# Altium schematic sheet 09A_USB_HUB.SchDoc
size 420 x 297 mm
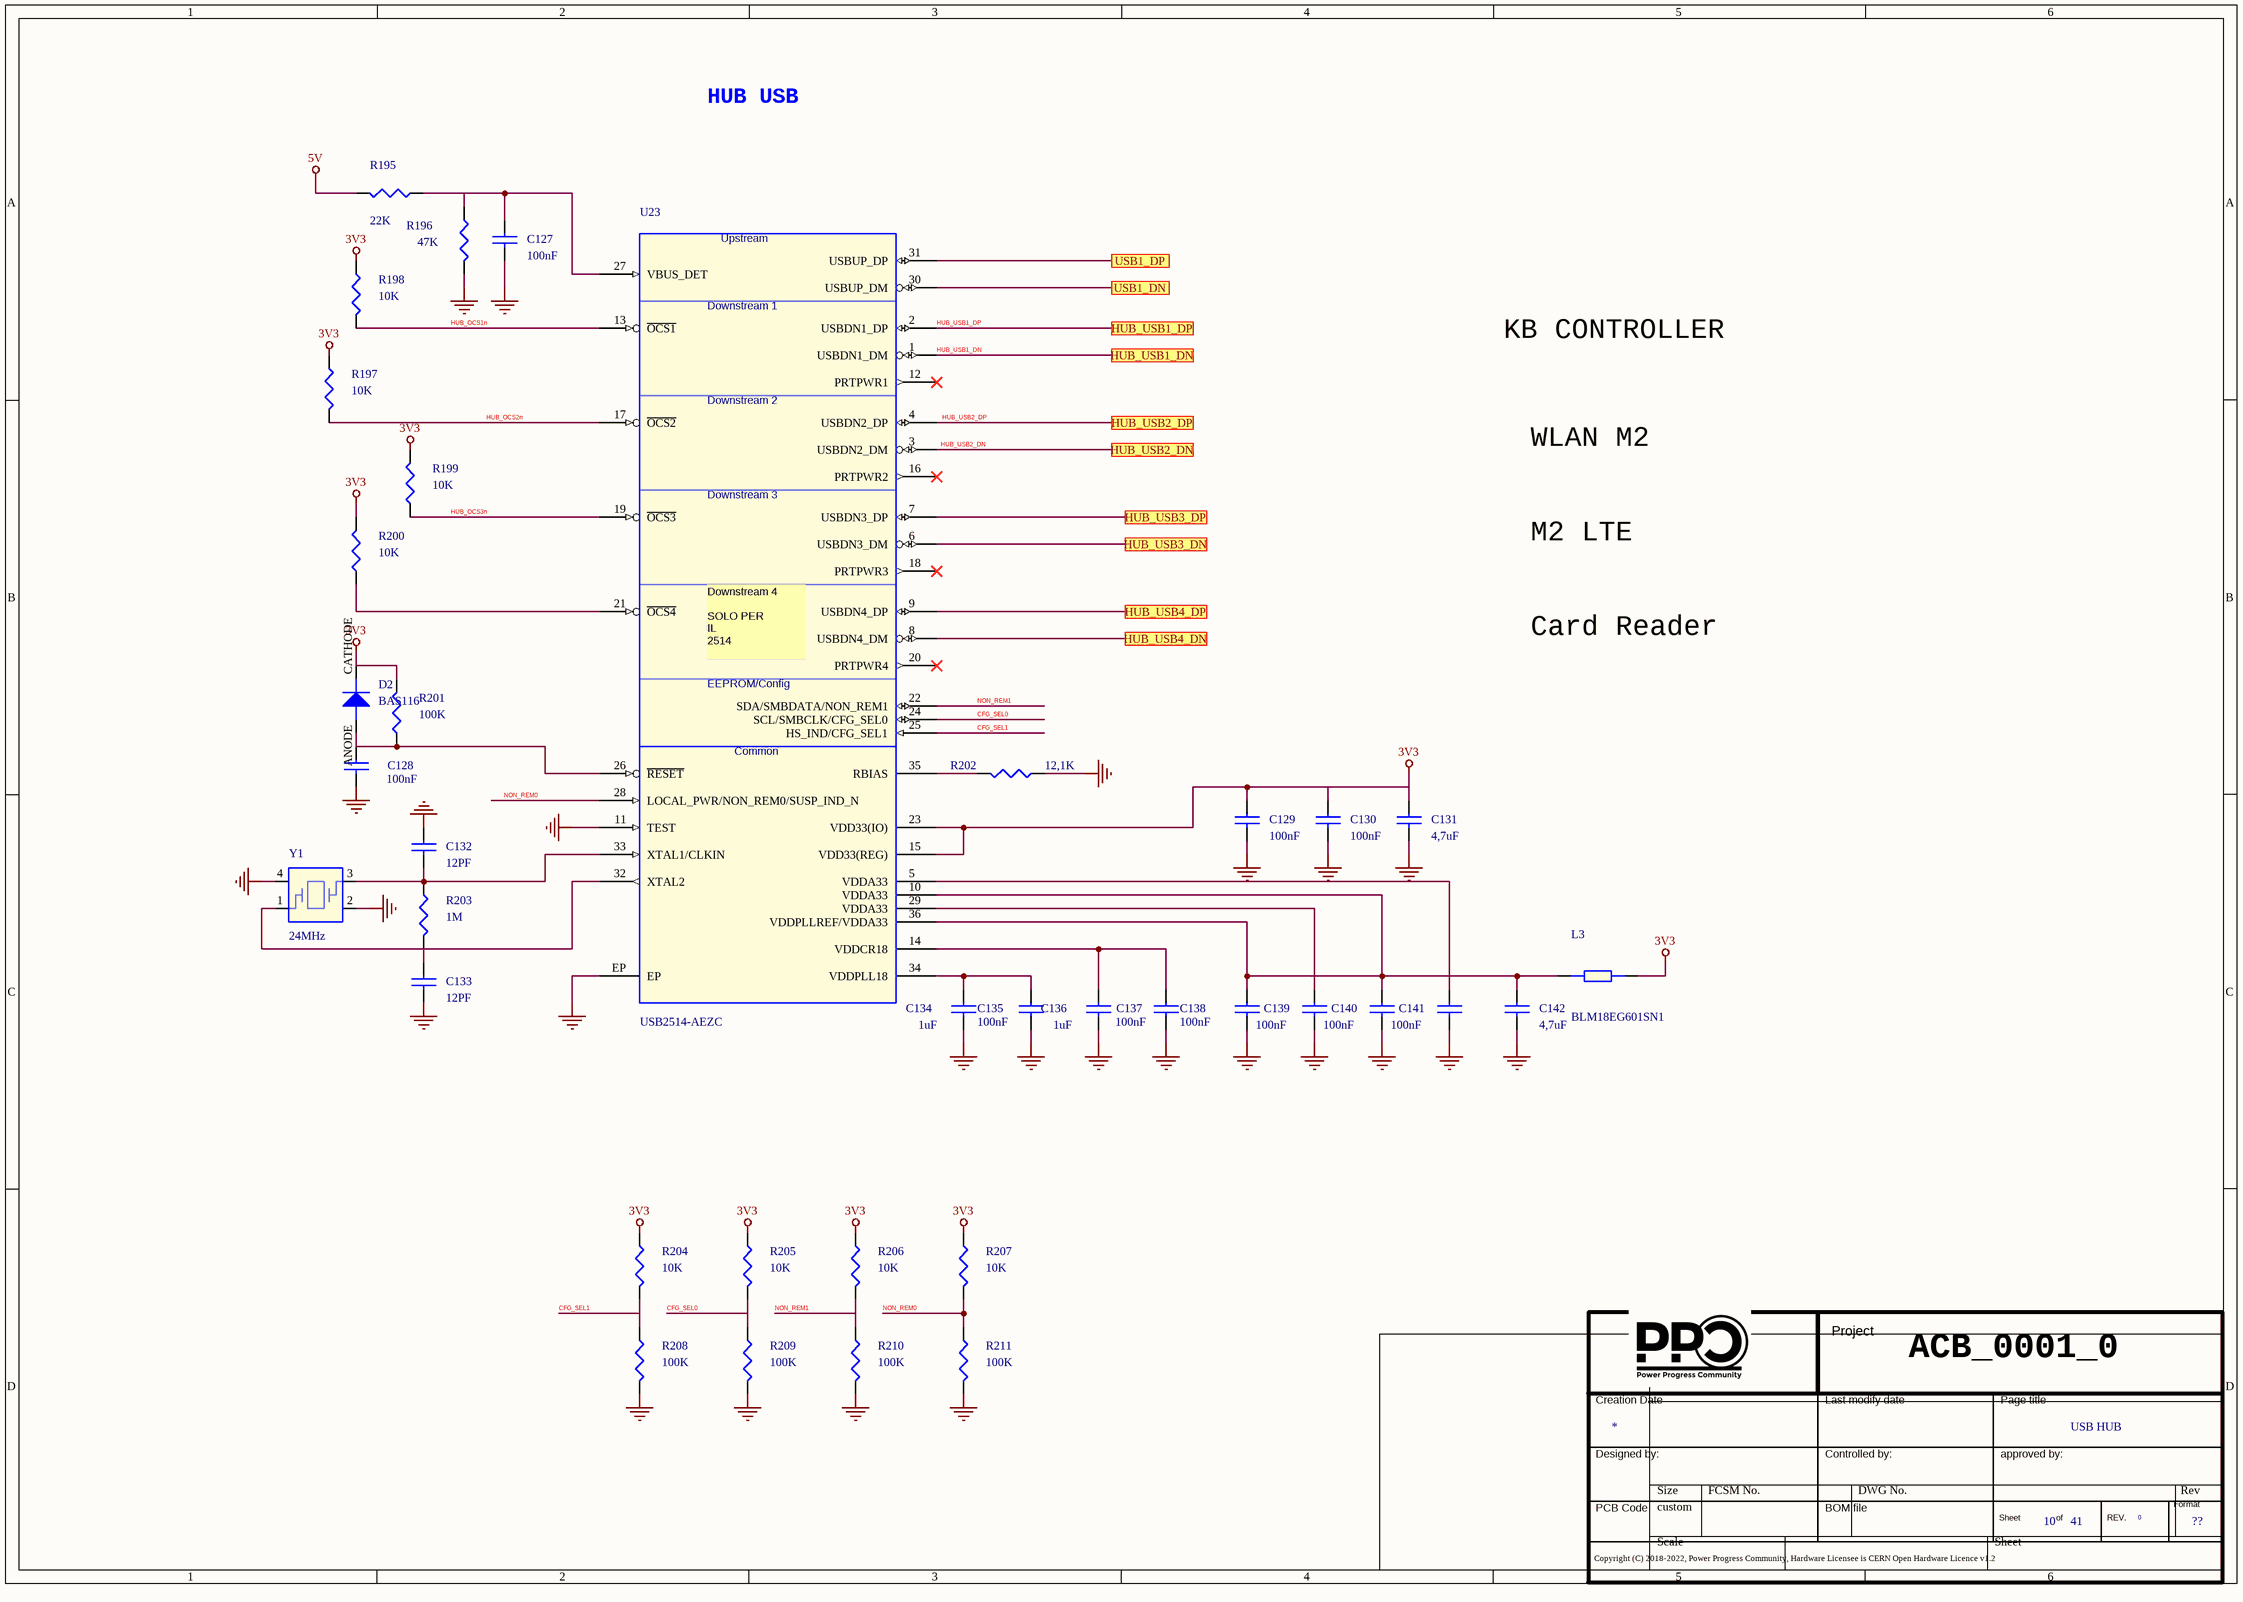
[diagram p0: 09A_USB_HUB.SchDoc]

## Parts
*  Doc: USB HUB  Page Count: 41  Page Number: 10  Page Size: ??  RevCode: 0  (hidden comment: Title_block_PPC)  (graphical)
C127  100nF  [SMD_0402]
C128  100nF  [SMD_0402]
C129  100nF  [SMD_0402]
C130  100nF  [SMD_0402]
C131  4,7uF  [SMD_0603]
C132  12PF  [SMD_0402]
C133  12PF  [SMD_0402]
C134  1uF  [SMD_0402]
C135  100nF  [SMD_0402]
C136  1uF  [SMD_0402]
C137  100nF  [SMD_0402]
C138  100nF  [SMD_0402]
C139  100nF  [SMD_0402]
C140  100nF  [SMD_0402]
C141  100nF  [SMD_0402]
C142  4,7uF  [SMD_0603]
D2  BAS116  [sod123]
L3  BLM18EG601SN1  [SMD_0603]
R195  22K  [SMD_0402]
R196  47K  [SMD_0402]
R197  10K  [SMD_0402]
R198  10K  [SMD_0402]
R199  10K  [SMD_0402]
R200  10K  [SMD_0402]
R201  100K  [SMD_0402]
R202  12,1K  [SMD_0402]
R203  1M  [SMD_0402]
R204  10K  [SMD_0402]
R205  10K  [SMD_0402]
R206  10K  [SMD_0402]
R207  10K  [SMD_0402]
R208  100K  [SMD_0402]
R209  100K  [SMD_0402]
R210  100K  [SMD_0402]
R211  100K  [SMD_0402]
U23  USB2514-AEZC  [QFN36]
Y1  24MHz  [SMD_2.5x3.2]

## Ports
HUB_USB1_DN, HUB_USB1_DP, HUB_USB2_DN, HUB_USB2_DP, HUB_USB3_DN, HUB_USB3_DP, HUB_USB4_DN, HUB_USB4_DP, USB1_DN, USB1_DP

## Nets
3V3: C129.1 C130.1 C131.1 D2.CATHODE L3.2 R197.1 R198.1 R199.1 R200.1 R201.1 R204.1 R205.1 R206.1 R207.1 U23.15(VDD33(REG)) U23.23(VDD33(IO))
5V: R195.1
GND: C127.2 C128.2 C129.2 C130.2 C131.2 C132.1 C133.2 C134.2 C135.2 C136.2 C137.2 C138.2 C139.2 C140.2 C141.2 C142.2 R196.1 R202.2 R208.2 R209.2 R210.2 R211.2 U23.11(TEST) U23.EP Y1.2 Y1.4
CFG_SEL0: R205.2 R209.1 U23.24(SCL/SMBCLK/CFG_SEL0)
CFG_SEL1: R204.2 R208.1 U23.25(HS_IND/CFG_SEL1)
HUB_OCS1n: R198.2 U23.13(~{OCS1})
HUB_OCS2n: R197.2 U23.17(~{OCS2})
HUB_OCS3n: R199.2 U23.19(~{OCS3})
HUB_USB1_DN: U23.1(USBDN1_DM) ; port HUB_USB1_DN
HUB_USB1_DP: U23.2(USBDN1_DP) ; port HUB_USB1_DP
HUB_USB2_DN: U23.3(USBDN2_DM) ; port HUB_USB2_DN
HUB_USB2_DP: U23.4(USBDN2_DP) ; port HUB_USB2_DP
HUB_USB3_DN: U23.6(USBDN3_DM) ; port HUB_USB3_DN
HUB_USB3_DP: U23.7(USBDN3_DP) ; port HUB_USB3_DP
HUB_USB4_DN: U23.8(USBDN4_DM) ; port HUB_USB4_DN
HUB_USB4_DP: U23.9(USBDN4_DP) ; port HUB_USB4_DP
NON_REM0: R207.2 R211.1 U23.28(LOCAL_PWR/NON_REM0/SUSP_IND_N)
NON_REM1: R206.2 R210.1 U23.22(SDA/SMBDATA/NON_REM1)
USB1_DN: U23.30(USBUP_DM) ; port USB1_DN
USB1_DP: U23.31(USBUP_DP) ; port USB1_DP
NetC127_1: C127.1 R195.2 R196.2 U23.27(VBUS_DET)
NetC128_1: C128.1 D2.ANODE R201.2 U23.26(~{RESET})
NetC132_2: C132.2 R203.1 U23.33(XTAL1/CLKIN) Y1.3
NetC133_1: C133.1 R203.2 U23.32(XTAL2) Y1.1
NetC134_1: C134.1 C135.1 U23.34(VDDPLL18)
NetC136_1: C136.1 C137.1 U23.14(VDDCR18)
NetC138_1: C138.1 C139.1 C140.1 C141.1 C142.1 L3.1 U23.5(VDDA33) U23.10(VDDA33) U23.29(VDDA33) U23.36(VDDPLLREF/VDDA33)
NetR200_2: R200.2 U23.21(~{OCS4})
NetR202_1: R202.1 U23.35(RBIAS)

Not connected (* = marked no-connect by the designer): U23 12(PRTPWR1)* 16(PRTPWR2)* 18(PRTPWR3)* 20(PRTPWR4)*

## Notes on the sheet
- HUB USB
- KB CONTROLLER
- WLAN M2
- M2 LTE
- Card Reader
- ACB_0001_0
- (in symbol Title_block_PPC) Project; Creation Date; Last modify date; Page title; Designed by:; Controlled by:; approved by:; Format; PCB Code; BOM file; Sheet; of; REV.; Copyright (C) 2018-2022, Power Progress Community, Hardware Licensee is CERN Open Hardware Licence v1.2
- (in symbol USB2513_QFN36_0) Upstream; Downstream 1; Downstream 2; Downstream 3; Downstream 4 / SOLO PER / IL / 2514; EEPROM/Config; Common

## Library data of the parts
* = Title_block_PPC: Title: T2080PCIe; Author: MICETEK; Page Create Date: March  8, 1995; Page Title: ?; Page Modify Date: *
C127 C129 C130 C135 C139-C141 = CAP NP_Dup5: COND.CER. 100NF 50V 0402 X7R SMD; Manufacturer Part Number 1: CGA2B3X7R1H104M050BD; Manufacturer 1: TDK; Part Number: PASSIVE_24; TECNO77: C0402; RSM: RC0402; Distributor 1: MURATA ELETTRONICA SPA; Part Type: Capacitors\Ceramic\SMD\0402; PCB Footprint: SMD_0402
C128 C137 C138 = CAP NP_Dup5: COND.CER. 100NF 50V 0402 X7R SMD; Part Number: PASSIVE_24; Manufacturer 1: TDK; Manufacturer Part Number 1: CGA2B3X7R1H104M050BD; TECNO77: C0402; RSM: RC0402; Part Type: Capacitors\Ceramic\SMD\0402; Distributor 1: MURATA ELETTRONICA SPA; PCB Footprint: SMD_0402
C131 = CAP NP_Dup5: COND.CER.4,7uF 16V X5R 0603 SMD; Part Number: PASSIVE_1405; Manufacturer 1: SAMSUNG; Manufacturer Part Number 1: CL10A475KO8NNNC; TECNO77: C0603; RSM: RC0603; Part Type: Capacitors\Ceramic\SMD\0603; Distributor 1: DIGIKEY (490-3302-1-ND); PCB Footprint: SMD_0603
C132 = CAP NP_Dup5: COND.CER.12PF 50V 0402 NPO/COG SMD; Part Number: PASSIVE_36; Manufacturer 1: Murata; Manufacturer Part Number 1: GRM1555C1H120JZ01D; TECNO77: C0402; RSM: RC0402; Part Type: Capacitors\Ceramic\SMD\0402; Distributor 1: MURATA ELETTRONICA SPA; PCB Footprint: SMD_0402
C133 = CAP NP_Dup5: COND.CER.12PF 50V 0402 NPO/COG SMD; Manufacturer Part Number 1: GRM1555C1H120JZ01D; Manufacturer 1: Murata; Part Number: PASSIVE_36; TECNO77: C0402; RSM: RC0402; Distributor 1: MURATA ELETTRONICA SPA; Part Type: Capacitors\Ceramic\SMD\0402; PCB Footprint: SMD_0402
C134 C136 = CAP NP_Dup3: CAP CER 1UF 25V X6S 0402; Manufacturer Part Number 1: GRM155C81E105KE11D; Manufacturer 1: Murata; Part Number: PASSIVE_1446; RSM: RC0402; Part Type: Capacitors\Ceramic\SMD\0402; PCB Footprint: SMD_0402
C142 = CAP NP_Dup5: COND.CER.4,7uF 16V X5R 0603 SMD; Manufacturer Part Number 1: CL10A475KO8NNNC; Manufacturer 1: SAMSUNG; Part Number: PASSIVE_1405; TECNO77: C0603; RSM: RC0603; Distributor 1: DIGIKEY (490-3302-1-ND); Part Type: Capacitors\Ceramic\SMD\0603; PCB Footprint: SMD_0603
D2 = DIODE: DIODO, ALTA VELOCITÀ, SOD123; Part Number: DISCRETE_54; Manufacturer 1: NXP; Manufacturer Part Number 1: BAS116H,115; RSM: SOD123-AK; Part Type: Diodes\Rectifiers; PCB Footprint: sod123; Distributor 1: FARNELL(2319131)
L3 = FERRITE_BEAD: FERRITE BEAD 600ohm 500mA 0603 SMD; Part Number: PASSIVE_377; Manufacturer 1: Murata; Manufacturer Part Number 1: BLM18EG601SN1 SMD; RSM: RC0603; Part Type: Ferrite Beads\SMD\0603; PCB Footprint: SMD_0603
R195 = R_Dup5: RESIS.CHIP 22K 5% 0402 SMD; Part Number: PASSIVE_843; Manufacturer 1: ROYAL OHM; TECNO77: R0402; RSM: RC0402; Part Type: Resistors\Fixed\SMD\0402\5%; Manufacturer Part Number 1: RESIS.CHIP 22K 5% 0402 SMD; Distributor 1: CAMEL ELETTRONICA SRL  #; PCB Footprint: SMD_0402
R196 = R_Dup7: RESIS.CHIP 47K 1% 0402 SMD; Manufacturer 1: ROYAL OHM; Part Number: PASSIVE_737; TECNO77: R0402; RSM: RC0402; Distributor 1: CAMEL ELETTRONICA SRL  #; Manufacturer Part Number 1: RESIS.CHIP 47K 1% 0402 SMD; Part Type: Resistors\Fixed\SMD\0402\1%; PCB Footprint: SMD_0402
R197-R200 R204-R207 = R_Dup6: RESIS.CHIP 10K 1% 0402 SMD; Part Number: PASSIVE_584; Manufacturer 1: ROYAL OHM; RSM: RC0402; Part Type: Resistors\Fixed\SMD\0402\1%; PCB Footprint: SMD_0402; Manufacturer Part Number 1: RESIS.CHIP 10K 1% 0402 SMD
R201 R208-R211 = R_Dup6: RESIS.CHIP 100K 5% 0402 SMD; Part Number: PASSIVE_813; Manufacturer 1: ROYAL OHM; RSM: RC0402; Part Type: Resistors\Fixed\SMD\0402\5%; PCB Footprint: SMD_0402; Manufacturer Part Number 1: RESIS.CHIP 100K 5% 0402 SMD
R202 = R_Dup7: RESIS.CHIP 12,1K 1% 0402 SMD; Part Number: PASSIVE_590; Manufacturer 1: ROYAL OHM; TECNO77: R0402; RSM: RC0402; Part Type: Resistors\Fixed\SMD\0402\1%; Manufacturer Part Number 1: RESIS.CHIP 12,1K 1% 0402 SMD; Distributor 1: CAMEL ELETTRONICA SRL  #; PCB Footprint: SMD_0402
R203 = R_Dup7: RESIS.CHIP 1M 1% 0402 SMD; Manufacturer Part Number 1: RESIS.1M 1% 0402 SMD; Manufacturer 1: ROYAL OHM; Part Number: PASSIVE_630; TECNO77: R0402; RSM: RC0402; Distributor 1: CAMEL ELETTRONICA SRL  #; Part Type: Resistors\Fixed\SMD\0402\1%; PCB Footprint: SMD_0402
U23 = USB2513_QFN36_0: IC USB 2.0 4PORT HUB CTLR 64QFN; Manufacturer Part Number 1: USB2514B-AEZC; Manufacturer 1: MICROCHIP; Part Number: LOGIC_286; TECNO77: QFN36-6X6-P0.5; RSM: QFN-36-6X6-EP; PCB Footprint: QFN36; Distributor 1: DIGIKEY(886-USB2514B-AEZC); Part Type: USB\HUB
Y1 = CRYSTAL_4P_Dup1: CRYSTAL 24MHZ 10PF SMD; Manufacturer Part Number 1: 403C11A24M00000; Manufacturer 1: CTS; Part Number: MISC_160; TECNO77: OSC4P2.2(3.2X2.5)_SMT; RSM: XC-CTS-632; Distributor 1: DIGIKEY(CTX849CT-ND); Part Type: Quartz; PCB Footprint: SMD_2.5x3.2